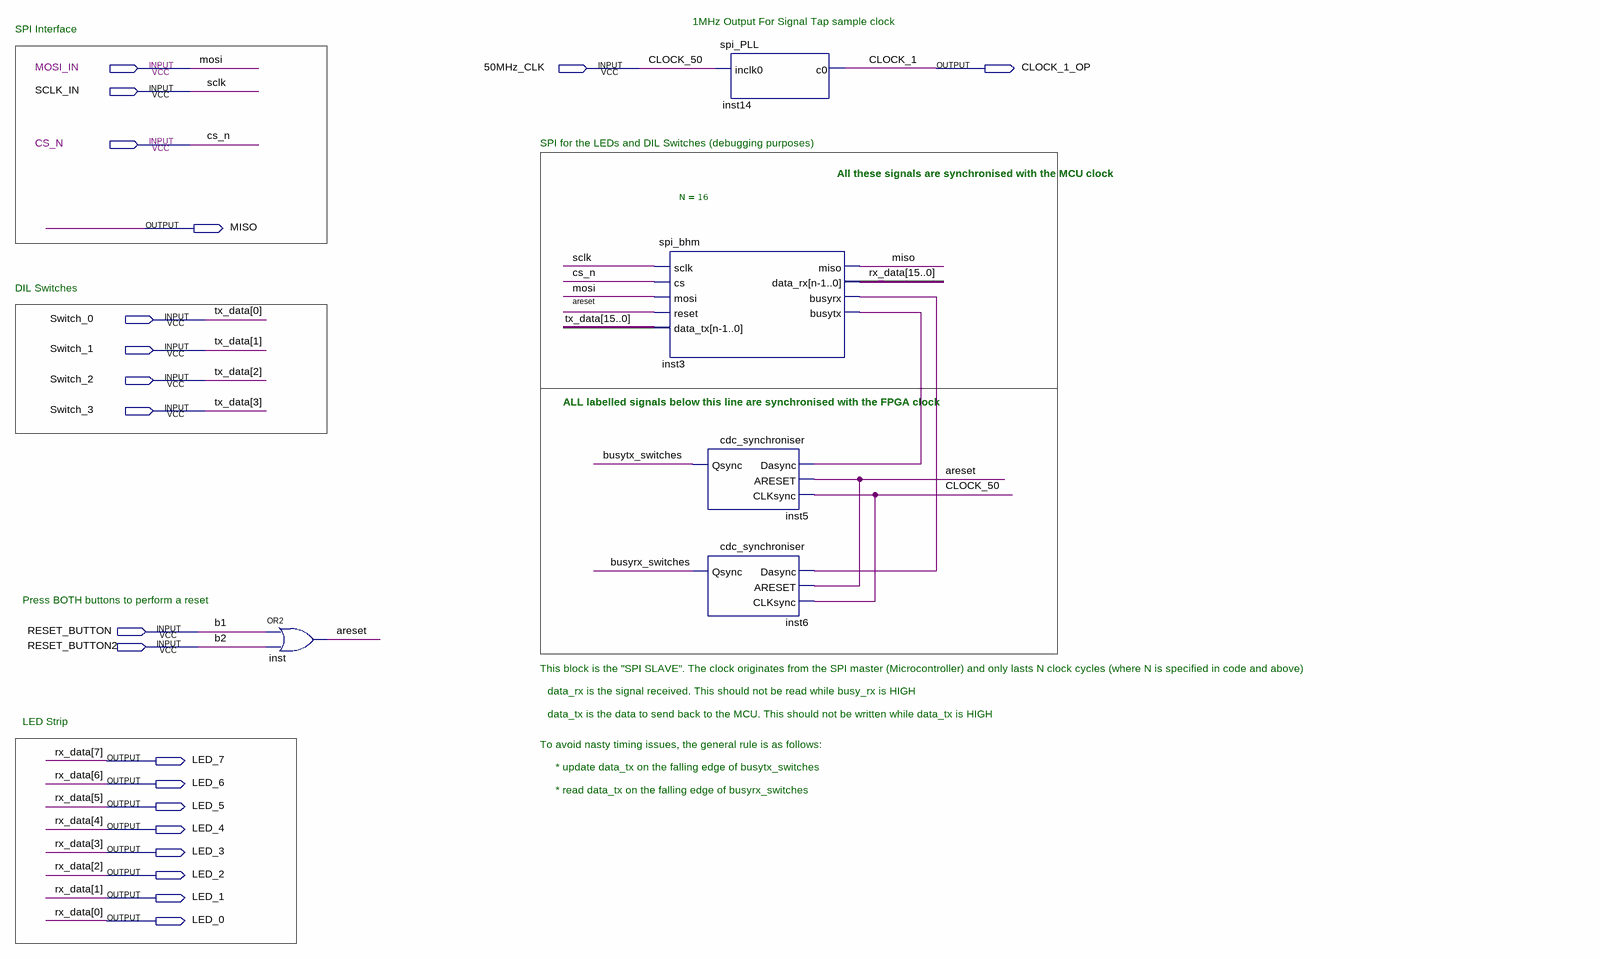
[diagram p0: schematic sheet]
// Quartus schematic spi_test.bdf as structural Verilog: 5 symbols, 20 pins
module spi_test (
  input  MOSI_IN,
  input  \50MHz_CLK ,
  input  SCLK_IN,
  input  CS_N,
  input  Switch_0,
  input  Switch_1,
  input  Switch_2,
  input  Switch_3,
  input  RESET_BUTTON,
  input  RESET_BUTTON2,
  output CLOCK_1_OP,
  output MISO,
  output LED_7,
  output LED_6,
  output LED_5,
  output LED_4,
  output LED_3,
  output LED_2,
  output LED_1,
  output LED_0
);

  wire areset, busyrx_switches, busytx_switches, inst3_busyrx, inst3_busytx;
  wire [15:4] tx_data;
  wire [15:8] rx_data;

  or inst (areset, RESET_BUTTON, RESET_BUTTON2);
  spi_bhm #(.N(16)) inst3 (
    .sclk(SCLK_IN), .cs(CS_N), .mosi(MOSI_IN), .reset(areset),
    .data_tx({tx_data, Switch_3, Switch_2, Switch_1, Switch_0}), .miso(MISO),
    .data_rx({rx_data, LED_7, LED_6, LED_5, LED_4, LED_3, LED_2, LED_1, LED_0}), .busyrx(inst3_busyrx),
    .busytx(inst3_busytx));
  spi_PLL inst14 (.inclk0(\50MHz_CLK ), .c0(CLOCK_1_OP));
  cdc_synchroniser inst5 (.Dasync(inst3_busytx), .ARESET(areset), .CLKsync(\50MHz_CLK ), .Qsync(busytx_switches));
  cdc_synchroniser inst6 (.Dasync(inst3_busyrx), .ARESET(areset), .CLKsync(\50MHz_CLK ), .Qsync(busyrx_switches));

  // Other names for the same wires on the sheet: b1 = RESET_BUTTON; b2 = RESET_BUTTON2; CLOCK_1 = CLOCK_1_OP;
  //   CLOCK_50 = \50MHz_CLK ; mosi = MOSI_IN; rx_data[7:0] = {LED_7, LED_6, LED_5, LED_4, LED_3, LED_2, LED_1, LED_0};
  //   sclk = SCLK_IN; tx_data[3:0] = {Switch_3, Switch_2, Switch_1, Switch_0}

  // Notes on the sheet:
  //   1MHz Output For Signal Tap sample clock
  //   SPI Interface
  //   SPI for the LEDs and DIL Switches (debugging purposes)
  //   All these signals are synchronised with the MCU clock
  //   DIL Switches
  //   ALL labelled signals below this line are synchronised with the FPGA clock
  //   Press BOTH buttons to perform a reset
  //   This block is the "SPI SLAVE". The clock originates from the SPI master (Microcontroller) and only lasts N clock cycles (where N is specified in code and above)
  //   data_rx is the signal received. This should not be read while busy_rx is HIGH
  //   data_tx is the data to send back to the MCU. This should not be written while data_tx is HIGH
  //   LED Strip
  //   To avoid nasty timing issues, the general rule is as follows: 
  //   * update data_tx on the falling edge of busytx_switches
  //   * read data_tx on the falling edge of busyrx_switches
endmodule
